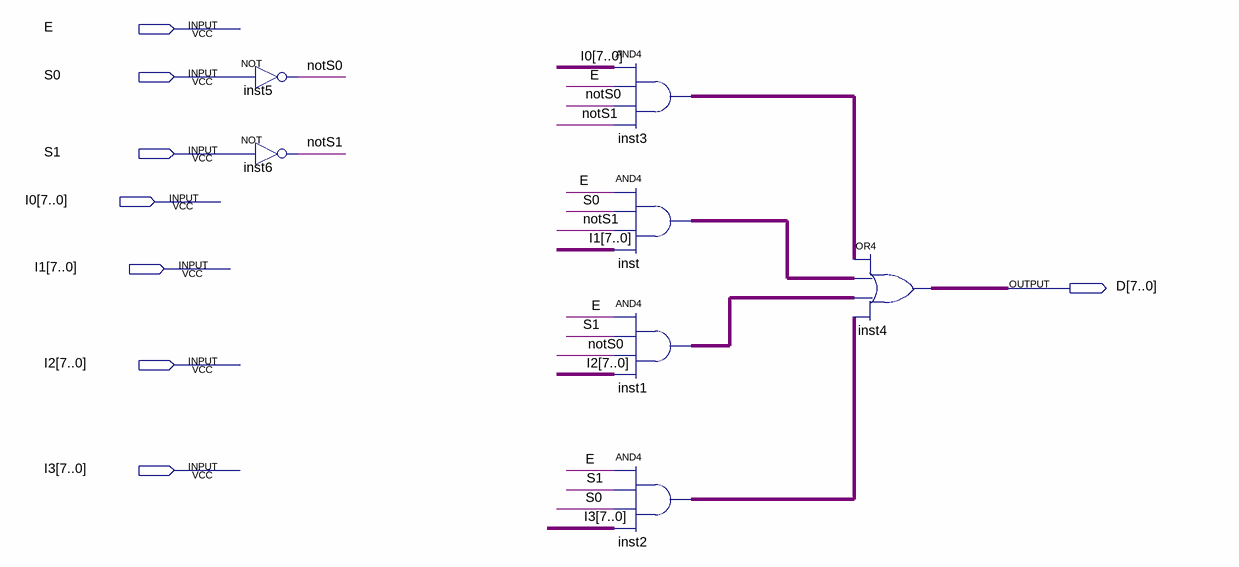
[diagram p0: schematic sheet]
// Quartus schematic mp4-2.bdf as structural Verilog: 7 symbols, 8 pins
module \mp4-2  (
  input  E,
  input  S0,
  input  S1,
  input  [7:0] I0,
  input  [7:0] I1,
  input  [7:0] I2,
  input  [7:0] I3,
  output [7:0] D
);

  wire notS0, notS1;
  wire [7:0] inst1_out, inst2_out, inst3_out, inst_out;

  not inst5 (notS0, S0);
  not inst6 (notS1, S1);
  assign inst3_out = I0 & {8{E}} & {8{notS0}} & {8{notS1}};  // AND4 inst3, 8 bits wide
  assign inst_out = {8{E}} & {8{S0}} & {8{notS1}} & I1;  // AND4 inst, 8 bits wide
  assign inst1_out = {8{E}} & {8{S1}} & {8{notS0}} & I2;  // AND4 inst1, 8 bits wide
  assign inst2_out = {8{E}} & {8{S1}} & {8{S0}} & I3;  // AND4 inst2, 8 bits wide
  assign D = inst3_out | inst_out | inst1_out | inst2_out;  // OR4 inst4, 8 bits wide
endmodule
